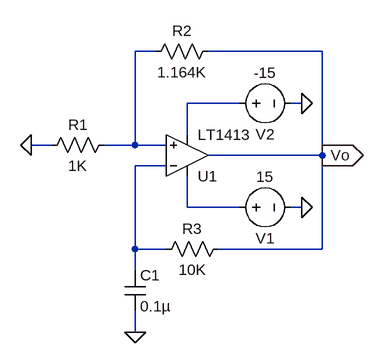
[diagram p0: schematic Run_3.asc]
Run_3.asc, the LTspice schematic file:
Version 4
SHEET 1 880 680
WIRE 240 48 208 48
WIRE 496 48 320 48
WIRE 368 128 288 128
WIRE 464 128 448 128
WIRE 288 176 288 128
WIRE 80 192 48 192
WIRE 208 192 208 48
WIRE 208 192 160 192
WIRE 256 192 208 192
WIRE 496 208 496 48
WIRE 496 208 320 208
WIRE 256 224 208 224
WIRE 288 288 288 240
WIRE 368 288 288 288
WIRE 464 288 448 288
WIRE 208 352 208 224
WIRE 256 352 208 352
WIRE 496 352 496 208
WIRE 496 352 336 352
WIRE 208 384 208 352
WIRE 208 480 208 448
FLAG 464 128 0
FLAG 464 288 0
FLAG 48 192 0
FLAG 208 480 0
FLAG 496 208 Vo
IOPIN 496 208 Out
SYMBOL OpAmps\\LT1413 288 272 M180
SYMATTR InstName U1
SYMBOL voltage 352 288 M90
WINDOW 0 32 56 VTop 2
WINDOW 3 -32 56 VBottom 2
WINDOW 123 0 0 Left 0
WINDOW 39 0 0 Left 0
SYMATTR InstName V1
SYMATTR Value 15
SYMBOL voltage 352 128 M90
WINDOW 0 32 56 VTop 2
WINDOW 3 -32 56 VBottom 2
WINDOW 123 0 0 Left 0
WINDOW 39 0 0 Left 0
SYMATTR InstName V2
SYMATTR Value -15
SYMBOL res 176 176 R90
WINDOW 0 0 56 VBottom 2
WINDOW 3 32 56 VTop 2
SYMATTR InstName R1
SYMATTR Value 1K
SYMBOL res 336 32 R90
WINDOW 0 0 56 VBottom 2
WINDOW 3 32 56 VTop 2
SYMATTR InstName R2
SYMATTR Value 1.164K
SYMBOL res 352 336 R90
WINDOW 0 0 56 VBottom 2
WINDOW 3 32 56 VTop 2
SYMATTR InstName R3
SYMATTR Value 10K
SYMBOL cap 192 384 R0
SYMATTR InstName C1
SYMATTR Value 0.1µ

The netlist it stands for:
* Run_3.asc
XU1 N001 N003 N004 N002 Vo LT1413  ; pins In+ In- V+ V- OUT
V1 N004 0 15
V2 N002 0 -15
R1 N001 0 1K
R2 Vo N001 1.164K
R3 Vo N003 10K
C1 N003 0 0.1µ
.lib LTC.lib
.backanno
.end